# Altium schematic sheet ina_extension_led_scheamtic.SchDoc
size A4
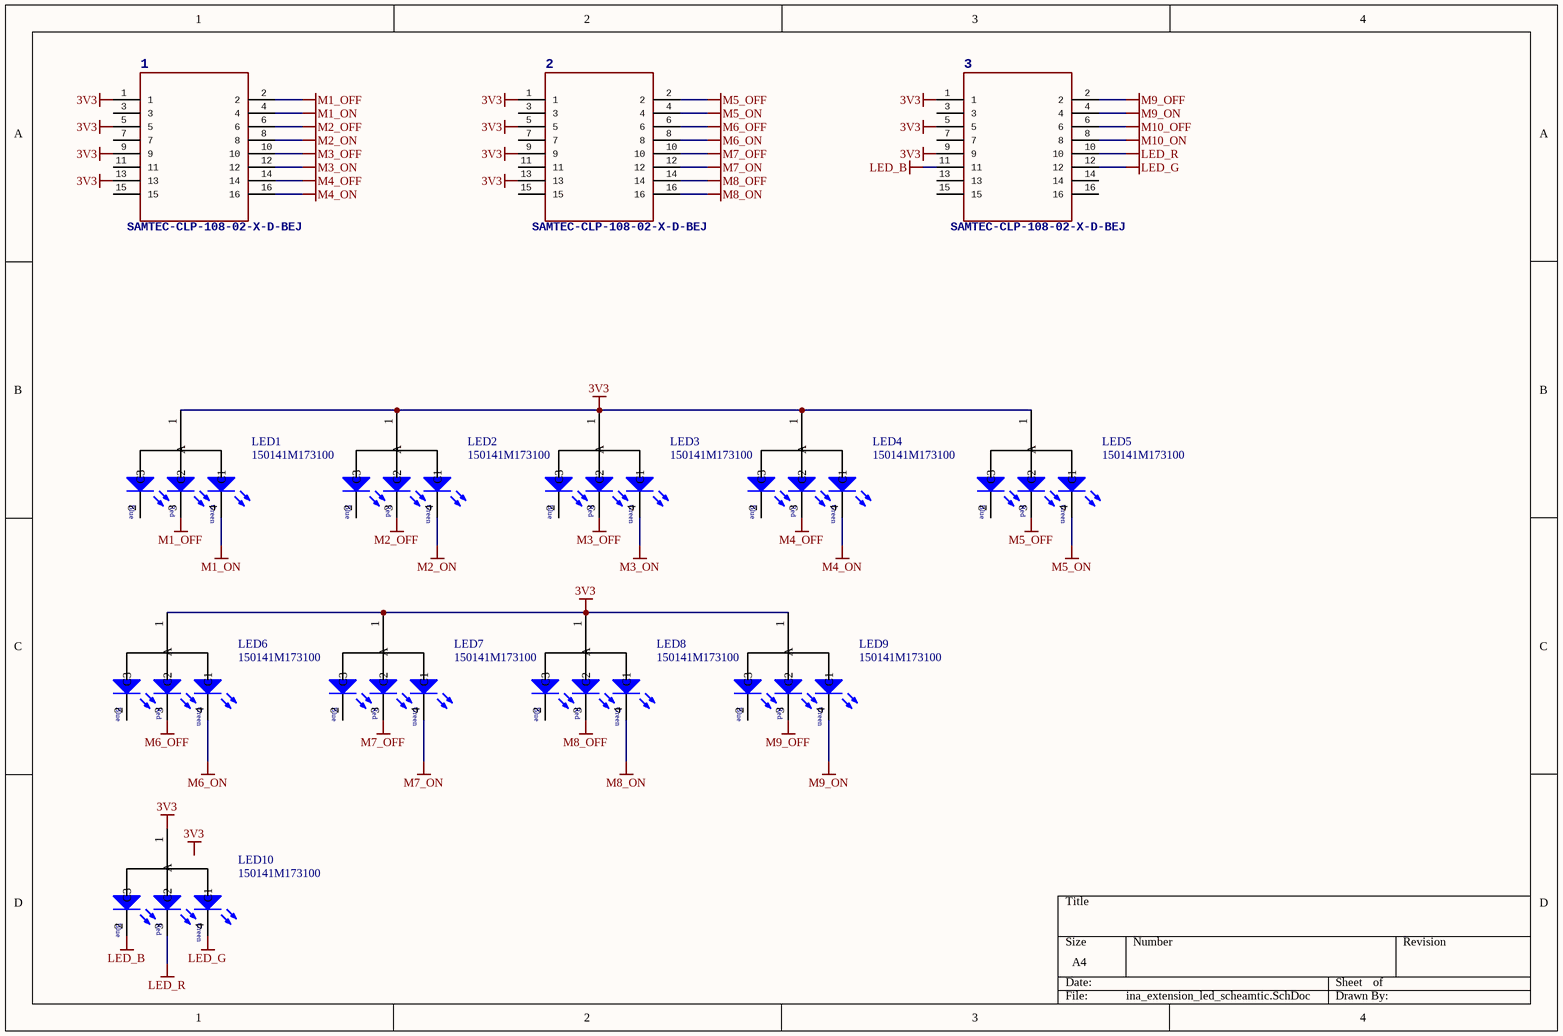
[diagram p0: ina_extension_led_scheamtic.SchDoc]

## Parts
1  SAMTEC-CLP-108-02-X-D-BEJ  [SAMTEC-CLP-108-02-X-D-BE]
2  SAMTEC-CLP-108-02-X-D-BEJ  [SAMTEC-CLP-108-02-X-D-BE]
3  SAMTEC-CLP-108-02-X-D-BEJ  [SAMTEC-CLP-108-02-X-D-BE]
LED1  150141M173100  [LED RGB 3528]
LED2  150141M173100  [LED RGB 3528]
LED3  150141M173100  [LED RGB 3528]
LED4  150141M173100  [LED RGB 3528]
LED5  150141M173100  [LED RGB 3528]
LED6  150141M173100  [LED RGB 3528]
LED7  150141M173100  [LED RGB 3528]
LED8  150141M173100  [LED RGB 3528]
LED9  150141M173100  [LED RGB 3528]
LED10  150141M173100  [LED RGB 3528]

## Nets
3V3: 1.1 1.5 1.9 1.13 2.1 2.5 2.9 2.13 3.1 3.5 3.9 LED1.1(A) LED2.1(A) LED3.1(A) LED4.1(A) LED5.1(A) LED6.1(A) LED7.1(A) LED8.1(A) LED9.1(A) LED10.1(A)
LED_B: 3.11 LED10.2(C3)
LED_G: 3.12 LED10.4(C1)
LED_R: 3.10 LED10.3(C2)
M1_OFF: 1.2 LED1.3(C2)
M1_ON: 1.4 LED1.4(C1)
M2_OFF: 1.6 LED2.3(C2)
M2_ON: 1.8 LED2.4(C1)
M3_OFF: 1.10 LED3.3(C2)
M3_ON: 1.12 LED3.4(C1)
M4_OFF: 1.14 LED4.3(C2)
M4_ON: 1.16 LED4.4(C1)
M5_OFF: 2.2 LED5.3(C2)
M5_ON: 2.4 LED5.4(C1)
M6_OFF: 2.6 LED6.3(C2)
M6_ON: 2.8 LED6.4(C1)
M7_OFF: 2.10 LED7.3(C2)
M7_ON: 2.12 LED7.4(C1)
M8_OFF: 2.14 LED8.3(C2)
M8_ON: 2.16 LED8.4(C1)
M9_OFF: 3.2 LED9.3(C2)
M9_ON: 3.4 LED9.4(C1)
M10_OFF: 3.6
M10_ON: 3.8

Not connected (* = marked no-connect by the designer): 1 3 7 11 15; 2 3 7 11 15; 3 3 7 13 14 15 16; LED1 2(C3); LED2 2(C3); LED3 2(C3); LED4 2(C3); LED5 2(C3); LED6 2(C3); LED7 2(C3); LED8 2(C3); LED9 2(C3)

## Notes on the sheet
- Labels drawn without touching a wire or pin: 3V3
- (in symbol LED RGB SMD) Blue; Red; Green

## Library data of the parts
1-3 = SAMTEC-CLP-108-02-X-D-BEJ: GateName_1: A; SymbolName_1: SAMTEC-CLP-108-02-X-D-BEA; DeviceName: J; LibraryName: SAMTEC-CLP-108-02-X-D-BE; DeviceSetName: SAMTEC-CLP-108-02-X-D-BE; Package: SAMTEC-CLP-108-02-X-D-BE
LED1-LED10 = LED RGB SMD: SMD Full-Color Top LED, WL-SFTW, Red & Green & Blue; Manufacturer: Würth Elektronik eiSos GmbH; PartNo: 150141M173100; ComponentLink1Description: Manufacturer; ComponentLink1URL: http://www.we-online.de; Created by: Christin Otto; Created Date: June 2013; ComponentLink2Description: Datasheet; ComponentLink2URL: http://katalog.we-online.com/led/datasheet/150141M173100.pdf; Color: Red & Green & Blue